# EAGLE design me433_2019_camera (EAGLE 9.3.2)
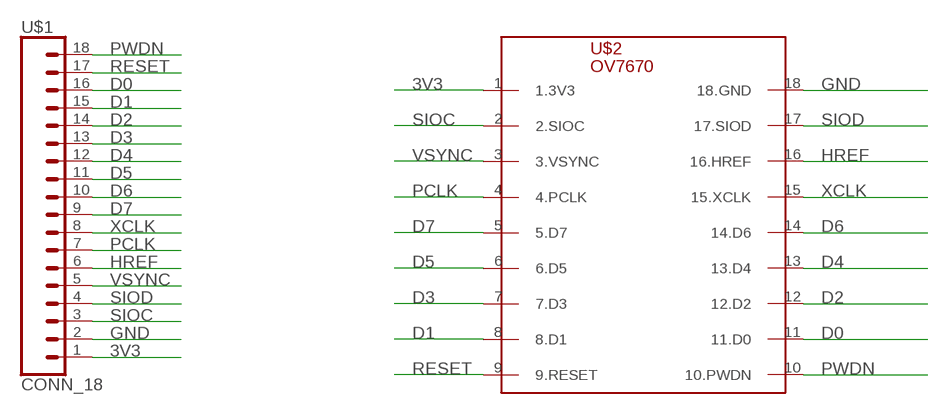
[diagram p0: schematic, sheet 1]

## Parts
U$1  CONN_18  [1X18]
U$2  OV7670  [2X09]

## Nets
3V3: U$1.1 U$2.1(1.3V3)
D0: U$1.16 U$2.11(11.D0)
D1: U$1.15 U$2.8(8.D1)
D2: U$1.14 U$2.12(12.D2)
D3: U$1.13 U$2.7(7.D3)
D4: U$1.12 U$2.13(13.D4)
D5: U$1.11 U$2.6(6.D5)
D6: U$1.10 U$2.14(14.D6)
D7: U$1.9 U$2.5(5.D7)
GND: U$1.2 U$2.18(18.GND)
HREF: U$1.6 U$2.16(16.HREF)
PCLK: U$1.7 U$2.4(4.PCLK)
PWDN: U$1.18 U$2.10(10.PWDN)
RESET: U$1.17 U$2.9(9.RESET)
SIOC: U$1.3 U$2.2(2.SIOC)
SIOD: U$1.4 U$2.17(17.SIOD)
VSYNC: U$1.5 U$2.3(3.VSYNC)
XCLK: U$1.8 U$2.15(15.XCLK)

## Library data of the parts
U$1 = me433_2019_camera:CONN_18
U$2 = me433_2019_camera:OV7670

## Board
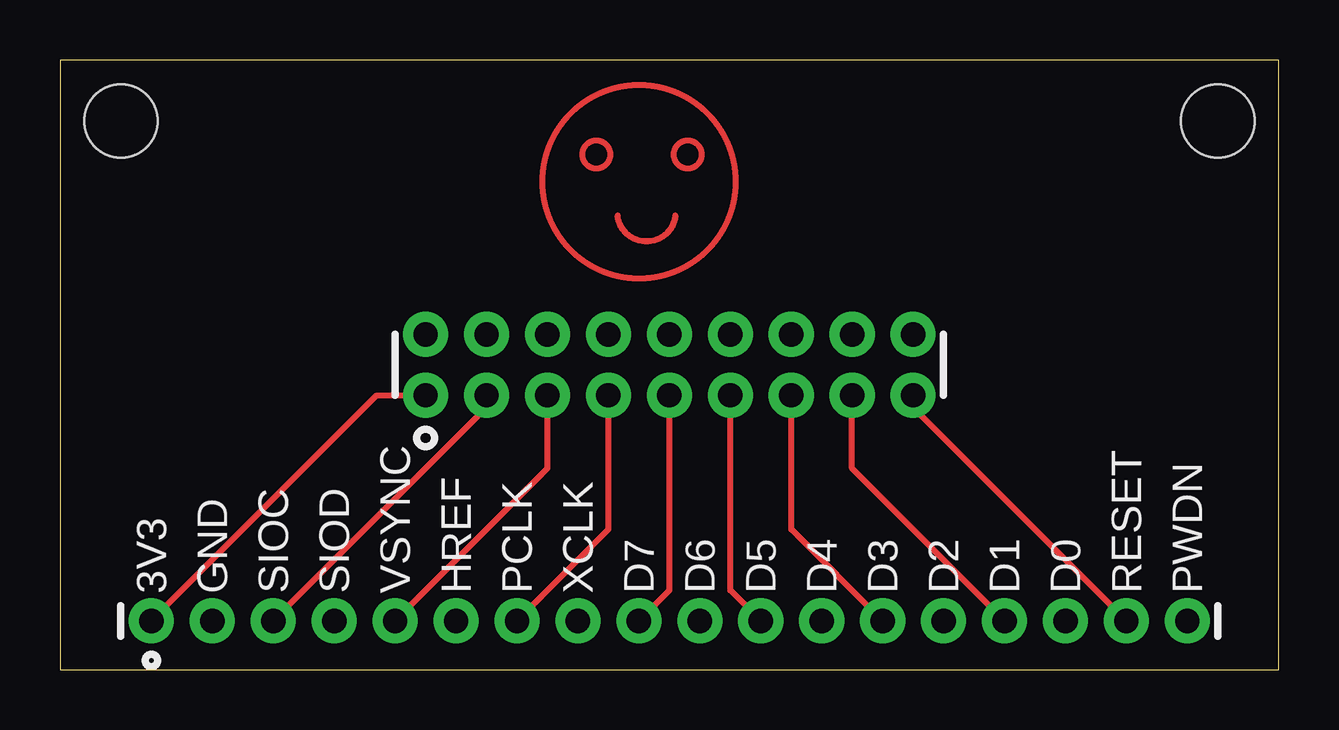
[diagram p1: board, top side]
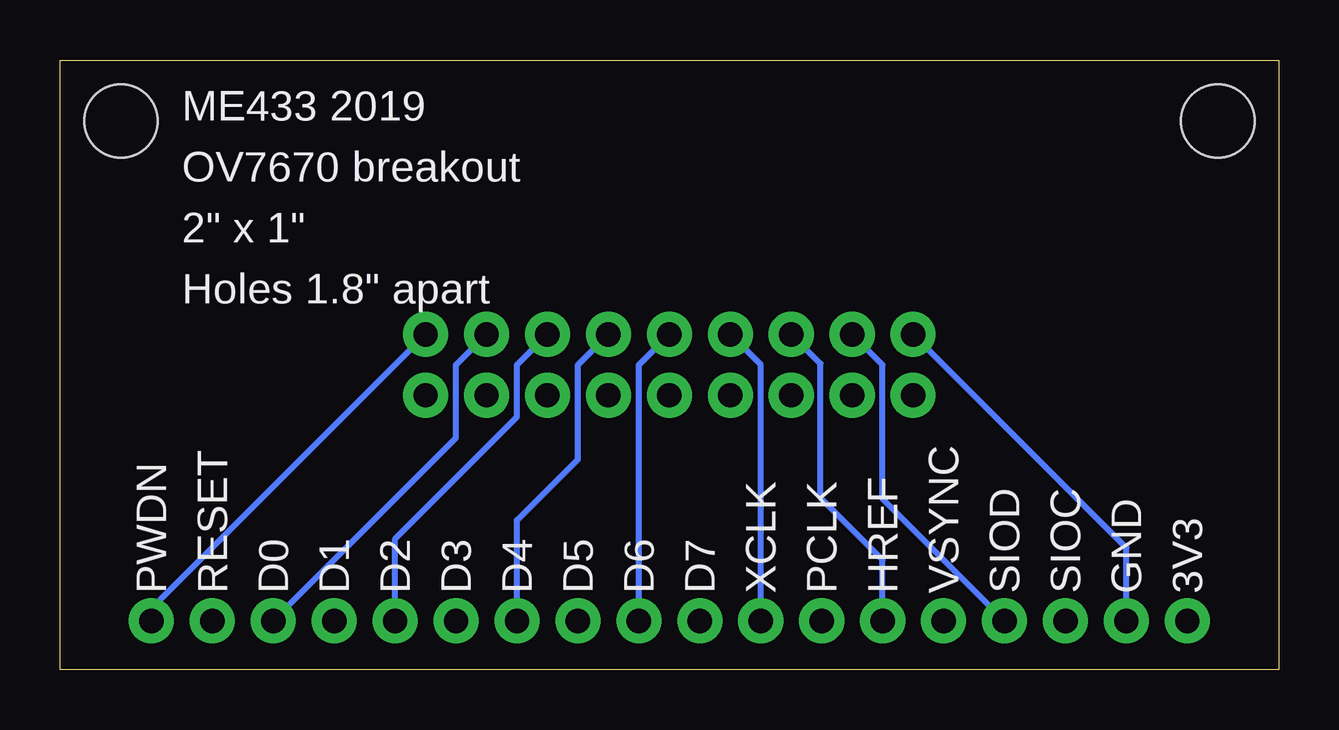
[diagram p2: board, bottom side, seen from below]

Size 50.8 x 25.4 mm. Coordinates in mm from the lower left corner, seen from the top.
Outline: 0,0 50.8,0 50.8,25.4 0,25.4 0,0
Copper layers (1*16): Top 0.035mm / dielectric 1.5mm / Bottom 0.035mm
Design rules "SeeedStudio_2layer_DRU_no_angle_20140221": minimum track width 6mil, minimum drill 12mil, track to track 6mil, track to pad 6mil, pad to pad 6mil, via to via 6mil, smd to smd 0mil, copper to edge 10mil, drill to drill 10mil, minimum pad ring 10mil, minimum via ring 6mil, stop-mask expansion 2mil, vias tented up to drill 100mil, thermal gap 10mil
Holes 3.05 mm at 2.54,22.86 48.26,22.86

### Footprints (pad centres in the part's own frame; a part is rotated, then mirrored left to right if it is on the bottom)
1X18 = drill 1.016 pad 1.88: 1 0,0; 2 2.54,0; 3 5.08,0; 4 7.62,0; 5 10.16,0; 6 12.7,0; 7 15.24,0; 8 17.78,0; 9 20.32,0; 10 22.86,0; 11 25.4,0; 12 27.94,0; 13 30.48,0; 14 33.02,0; 15 35.56,0; 16 38.1,0; 17 40.64,0; 18 43.18,0
2X09 = drill 1.016 pad 1.88: 1 0,0; 2 2.54,0; 3 5.08,0; 4 7.62,0; 5 10.16,0; 6 12.7,0; 7 15.24,0; 8 17.78,0; 9 20.32,0; 10 20.32,2.54; 11 17.78,2.54; 12 15.24,2.54; 13 12.7,2.54; 14 10.16,2.54; 15 7.62,2.54; 16 5.08,2.54; 17 2.54,2.54; 18 0,2.54

### Placement (x,y rotation side)
U$1  3.81,2.03 0 top
U$2  15.24,11.43 0 top

### Tracks (layer width: path | path; a pad name or v marks a point on that pad's centre or on a via)
3V3
  Top 0.254: U$1.1 13.21,11.43 U$2.1
D0
  Bottom 0.254: U$1.16 34.29,9.65 34.29,12.7 U$2.11
D1
  Top 0.254: U$1.15 33.02,8.38 U$2.8
D2
  Bottom 0.254: U$1.14 36.83,5.46 31.75,10.54 31.75,12.7 U$2.12
D3
  Top 0.254: U$1.13 30.48,5.84 U$2.7
D4
  Bottom 0.254: U$1.12 31.75,6.22 29.21,8.76 29.21,12.7 U$2.13
D5
  Top 0.254: U$1.11 27.94,3.3 U$2.6
D6
  Bottom 0.254: U$1.10 26.67,12.7 U$2.14
D7
  Top 0.254: U$1.9 25.4,3.3 U$2.5
GND
  Bottom 0.254: U$1.2 6.35,5.08 U$2.18
HREF
  Bottom 0.254: U$1.6 16.51,4.57 19.1,7.16 19.1,12.75 U$2.16
N$1
  Top 0.254: 25.65,18.92 arc-168 23.24,18.92
PCLK
  Top 0.254: U$1.7 22.86,5.84 U$2.4
PWDN
  Bottom 0.254: U$1.18 46.99,2.54 U$2.10
RESET
  Top 0.254: U$1.17 35.56,10.92 U$2.9
SIOC
  Top 0.254: U$1.3 17.78,10.92 U$2.2
SIOD
  Bottom 0.254: U$1.4 16.51,7.11 16.51,12.7 U$2.17
VSYNC
  Top 0.254: U$1.5 20.32,8.38 U$2.3
XCLK
  Bottom 0.254: U$1.8 21.59,12.7 U$2.15
(copper drawn outside any net)
  shapes: Top circle x3

### Text on the board
tPlace: 3V3 | GND | SIOC | SIOD | VSYNC | HREF | PCLK | XCLK | D7 | D6 | D5 | D4 | D3 | D2 | D1 | D0 | RESET | PWDN
bPlace: ME433 2019 | OV7670 breakout | 2" x 1" | Holes 1.8" apart | 3V3 | GND | SIOC | SIOD | VSYNC | HREF | PCLK | XCLK | D7 | D6 | D5 | D4 | D3 | D2 | D1 | D0 | RESET | PWDN